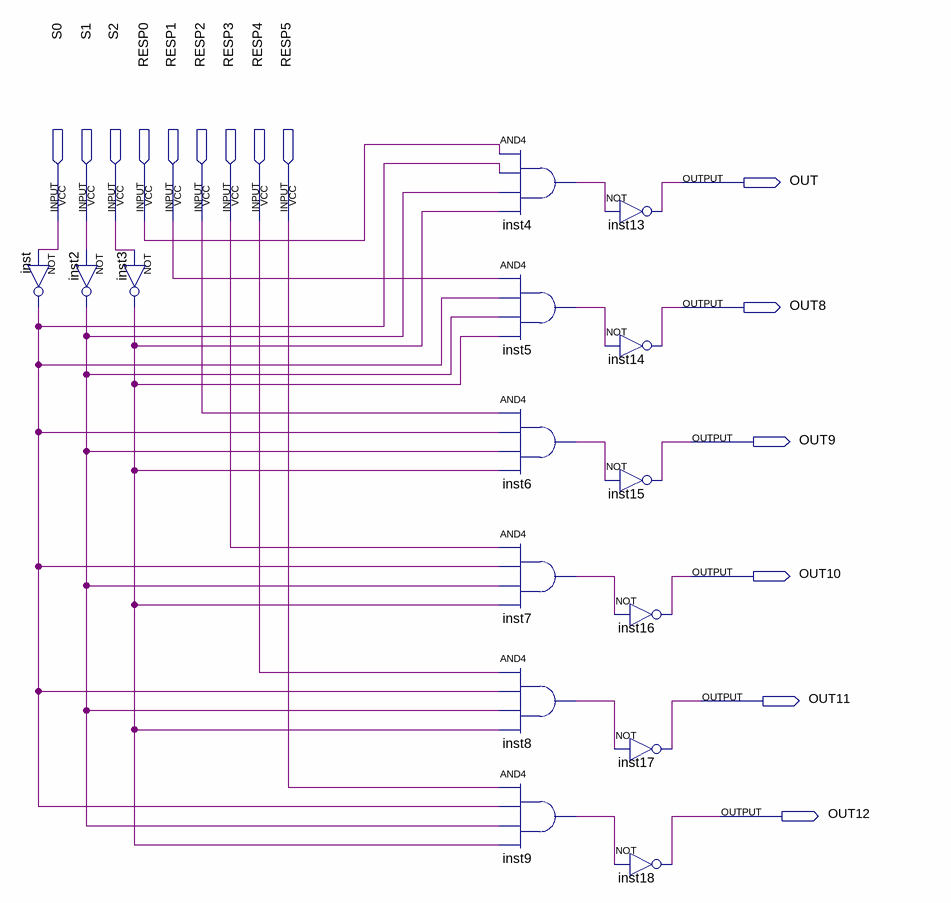
[diagram p0: schematic sheet]
// Quartus schematic SeletorAmaisB.bdf as structural Verilog: 15 symbols, 15 pins
module SeletorAmaisB (
  input  S0,
  input  S1,
  input  S2,
  input  RESP0,
  input  RESP1,
  input  RESP2,
  input  RESP3,
  input  RESP4,
  input  RESP5,
  output OUT,
  output OUT8,
  output OUT9,
  output OUT10,
  output OUT11,
  output OUT12
);

  wire inst2_out, inst3_out, inst4_out, inst5_out, inst6_out, inst7_out, inst8_out, inst9_out, inst_out;

  not inst (inst_out, S0);
  not inst2 (inst2_out, S1);
  not inst3 (inst3_out, S2);
  and inst4 (inst4_out, RESP0, inst_out, inst2_out, inst3_out);
  and inst5 (inst5_out, RESP1, inst_out, inst2_out, inst3_out);
  and inst6 (inst6_out, RESP2, inst_out, inst2_out, inst3_out);
  and inst7 (inst7_out, RESP3, inst_out, inst2_out, inst3_out);
  and inst8 (inst8_out, RESP4, inst_out, inst2_out, inst3_out);
  and inst9 (inst9_out, RESP5, inst_out, inst2_out, inst3_out);
  not inst13 (OUT, inst4_out);
  not inst14 (OUT8, inst5_out);
  not inst15 (OUT9, inst6_out);
  not inst16 (OUT10, inst7_out);
  not inst17 (OUT11, inst8_out);
  not inst18 (OUT12, inst9_out);
endmodule
